# Altium schematic sheet Power.SchDoc
size A4
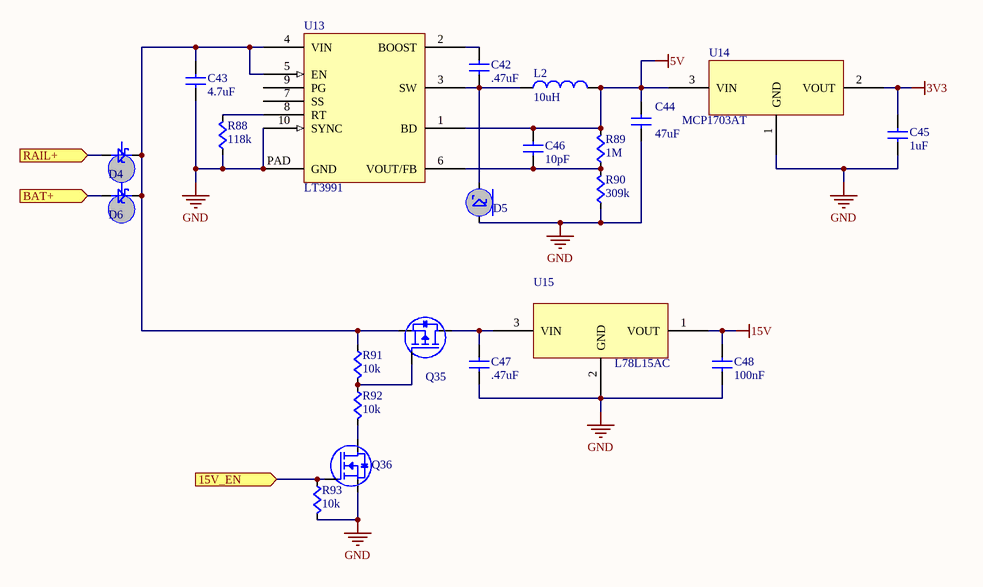
[diagram p0: Power.SchDoc]

## Parts
C42  value .47uF  [CAPC0603]  (hidden comment: Cap)
C43  value 4.7uF  [CAPC0805]  (hidden comment: Cap)
C44  value 47uF  [CAPC1206]  (hidden comment: Cap)
C45  value 1uF  [CAPC0603]  (hidden comment: Cap)
C46  value 10pF  [CAPC0603]  (hidden comment: Cap)
C47  value .47uF  [CAPC0603]  (hidden comment: Cap)
C48  value 100nF  [CAPC0603]  (hidden comment: Cap)
D4  DFLS160  [POWERDI123]  (value not drawn)
D5  DFLS160  [POWERDI123]  (value not drawn)
D6  DFLS160  [POWERDI123]  (value not drawn)
L2  Inductance: 10uH  [CDPH4D19F]  (hidden comment: Inductor)
Q35  FDN5618P  [PowerSOT-3]  (value not drawn)
Q36  FDN5630  [PowerSOT-3]  (value not drawn)
R88  value 118k  [RES0603]  (hidden comment: Res)
R89  value 1M  [RES0603]  (hidden comment: Res)
R90  value 309k  [RES0603]  (hidden comment: Res)
R91  value 10k  [RES0603]  (hidden comment: Res)
R92  value 10k  [RES0603]  (hidden comment: Res)
R93  value 10k  [RES0603]  (hidden comment: Res)
U13  LT3991  [LTS3991MSE]
U14  MCP1703AT  [MCP1703AT-xx02EMB]
U15  L78L15AC  [L78LxxAxUTR]

## Ports
15V_EN (in), BAT+ (in), RAIL+ (in)

## Nets
3V3: C45.1(A) U14.2(VOUT)
5V: C44.1(A) C46.2(B) L2.2(B) R89.1(A) U13.1(BD) U14.3(VIN)
15V: C48.1(A) U15.1(VOUT)
GND: C43.2(B) C44.2(B) C45.2(B) C47.2(B) C48.2(B) D5.A Q36.S R88.2(B) R90.2(B) R93.2(B) U13.10(SYNC) U13.PAD(GND) U14.1(GND) U15.2(GND)
15V_EN: Q36.G R93.1(A) ; port 15V_EN
BAT+: D6.A ; port BAT+
RAIL+: D4.A ; port RAIL+
NetC42_1: C42.1(A) U13.2(BOOST)
NetC42_2: C42.2(B) D5.C L2.1(A) U13.3(SW)
NetC43_1: C43.1(A) D4.C D6.C Q35.S R91.2(B) U13.4(VIN) U13.5(EN)
NetC46_1: C46.1(A) R89.2(B) R90.1(A) U13.6(VOUT/FB)
NetC47_1: C47.1(A) Q35.D U15.3(VIN)
NetQ35_G: Q35.G R91.1(A) R92.2(B)
NetQ36_D: Q36.D R92.1(A)
NetR88_1: R88.1(A) U13.8(RT)

Not connected (* = marked no-connect by the designer): U13 7(SS) 9(PG)

## Library data of the parts
D4-D6 = DFLS160: 1.0A Surface Mount Schottky Barrier Rectifier; Supplier 1: Digi-Key; Supplier Part Number 1: DFLS160DICT-ND
Q35 = FDN5618P: 60V P-Channel Logic Level PowerTrench MOSFET; Supplier 1: Digi-Key; Supplier Part Number 1: FDN5618PCT-ND
Q36 = FDN5630: 60V N-Channel PowerTrench MOSFET; Supplier 1: Digi-Key; Supplier Part Number 1: FDN5630CT-ND
U13 = LT3991: 55V, 1.2A Step-Down Regulator with 2.8uA Quiescent Current; Supplier 1: Digi-Key; Supplier Part Number 1: LT3991EMSE#PBF-ND
U14 = MCP1703AT: 250 mA, 16V, Low Quiescent Current LDO Regulator; pin to pad: 2>3 3>2; Supplier 1: Digi-Key; Supplier Part Number 1: MCP1703AT-3302E/MBTR-ND
U15 = L78LxxAx: Positive Voltage Regulator; Supplier 1: Digi-Key; Supplier Part Number 1: 497-7279-1-ND
C42-C48 = Cap: Supplier 1: Digi-Key
  C42 C47: Supplier Part Number 1: 445-7465-1-ND
  C43: Supplier Part Number 1: 1276-1248-1-ND
  C44: Supplier Part Number 1: 399-5508-1-ND
  C45: Supplier Part Number 1: 1276-1041-1-ND
  C46: Supplier Part Number 1: 478-5769-1-ND
  C48: Supplier Part Number 1: 1276-1000-1-ND
L2 = Inductor: Supplier 1: Digi-Key; Supplier Part Number 1: 308-1311-1-ND
R88-R93 = Res: Supplier 1: Digi-Key
  R88: Supplier Part Number 1: RMCF0603FT118KCT-ND
  R89: Supplier Part Number 1: 541-1.0MAYCT-ND
  R90: Supplier Part Number 1: RR08P309KDCT-ND
  R91-R93: Supplier Part Number 1: RMCF0603JT10K0CT-ND